# Altium schematic sheet MB_ps_io.SchDoc: Материнская плата
size 420 x 297 mm; DrawnBy: В.Титов; DocumentNumber: ХХХХ.468179.001 Э3; SheetNumber: 2; SheetTotal: 7; DocumentType: Схема электрическая принципиальная; Title2: Питание процессора
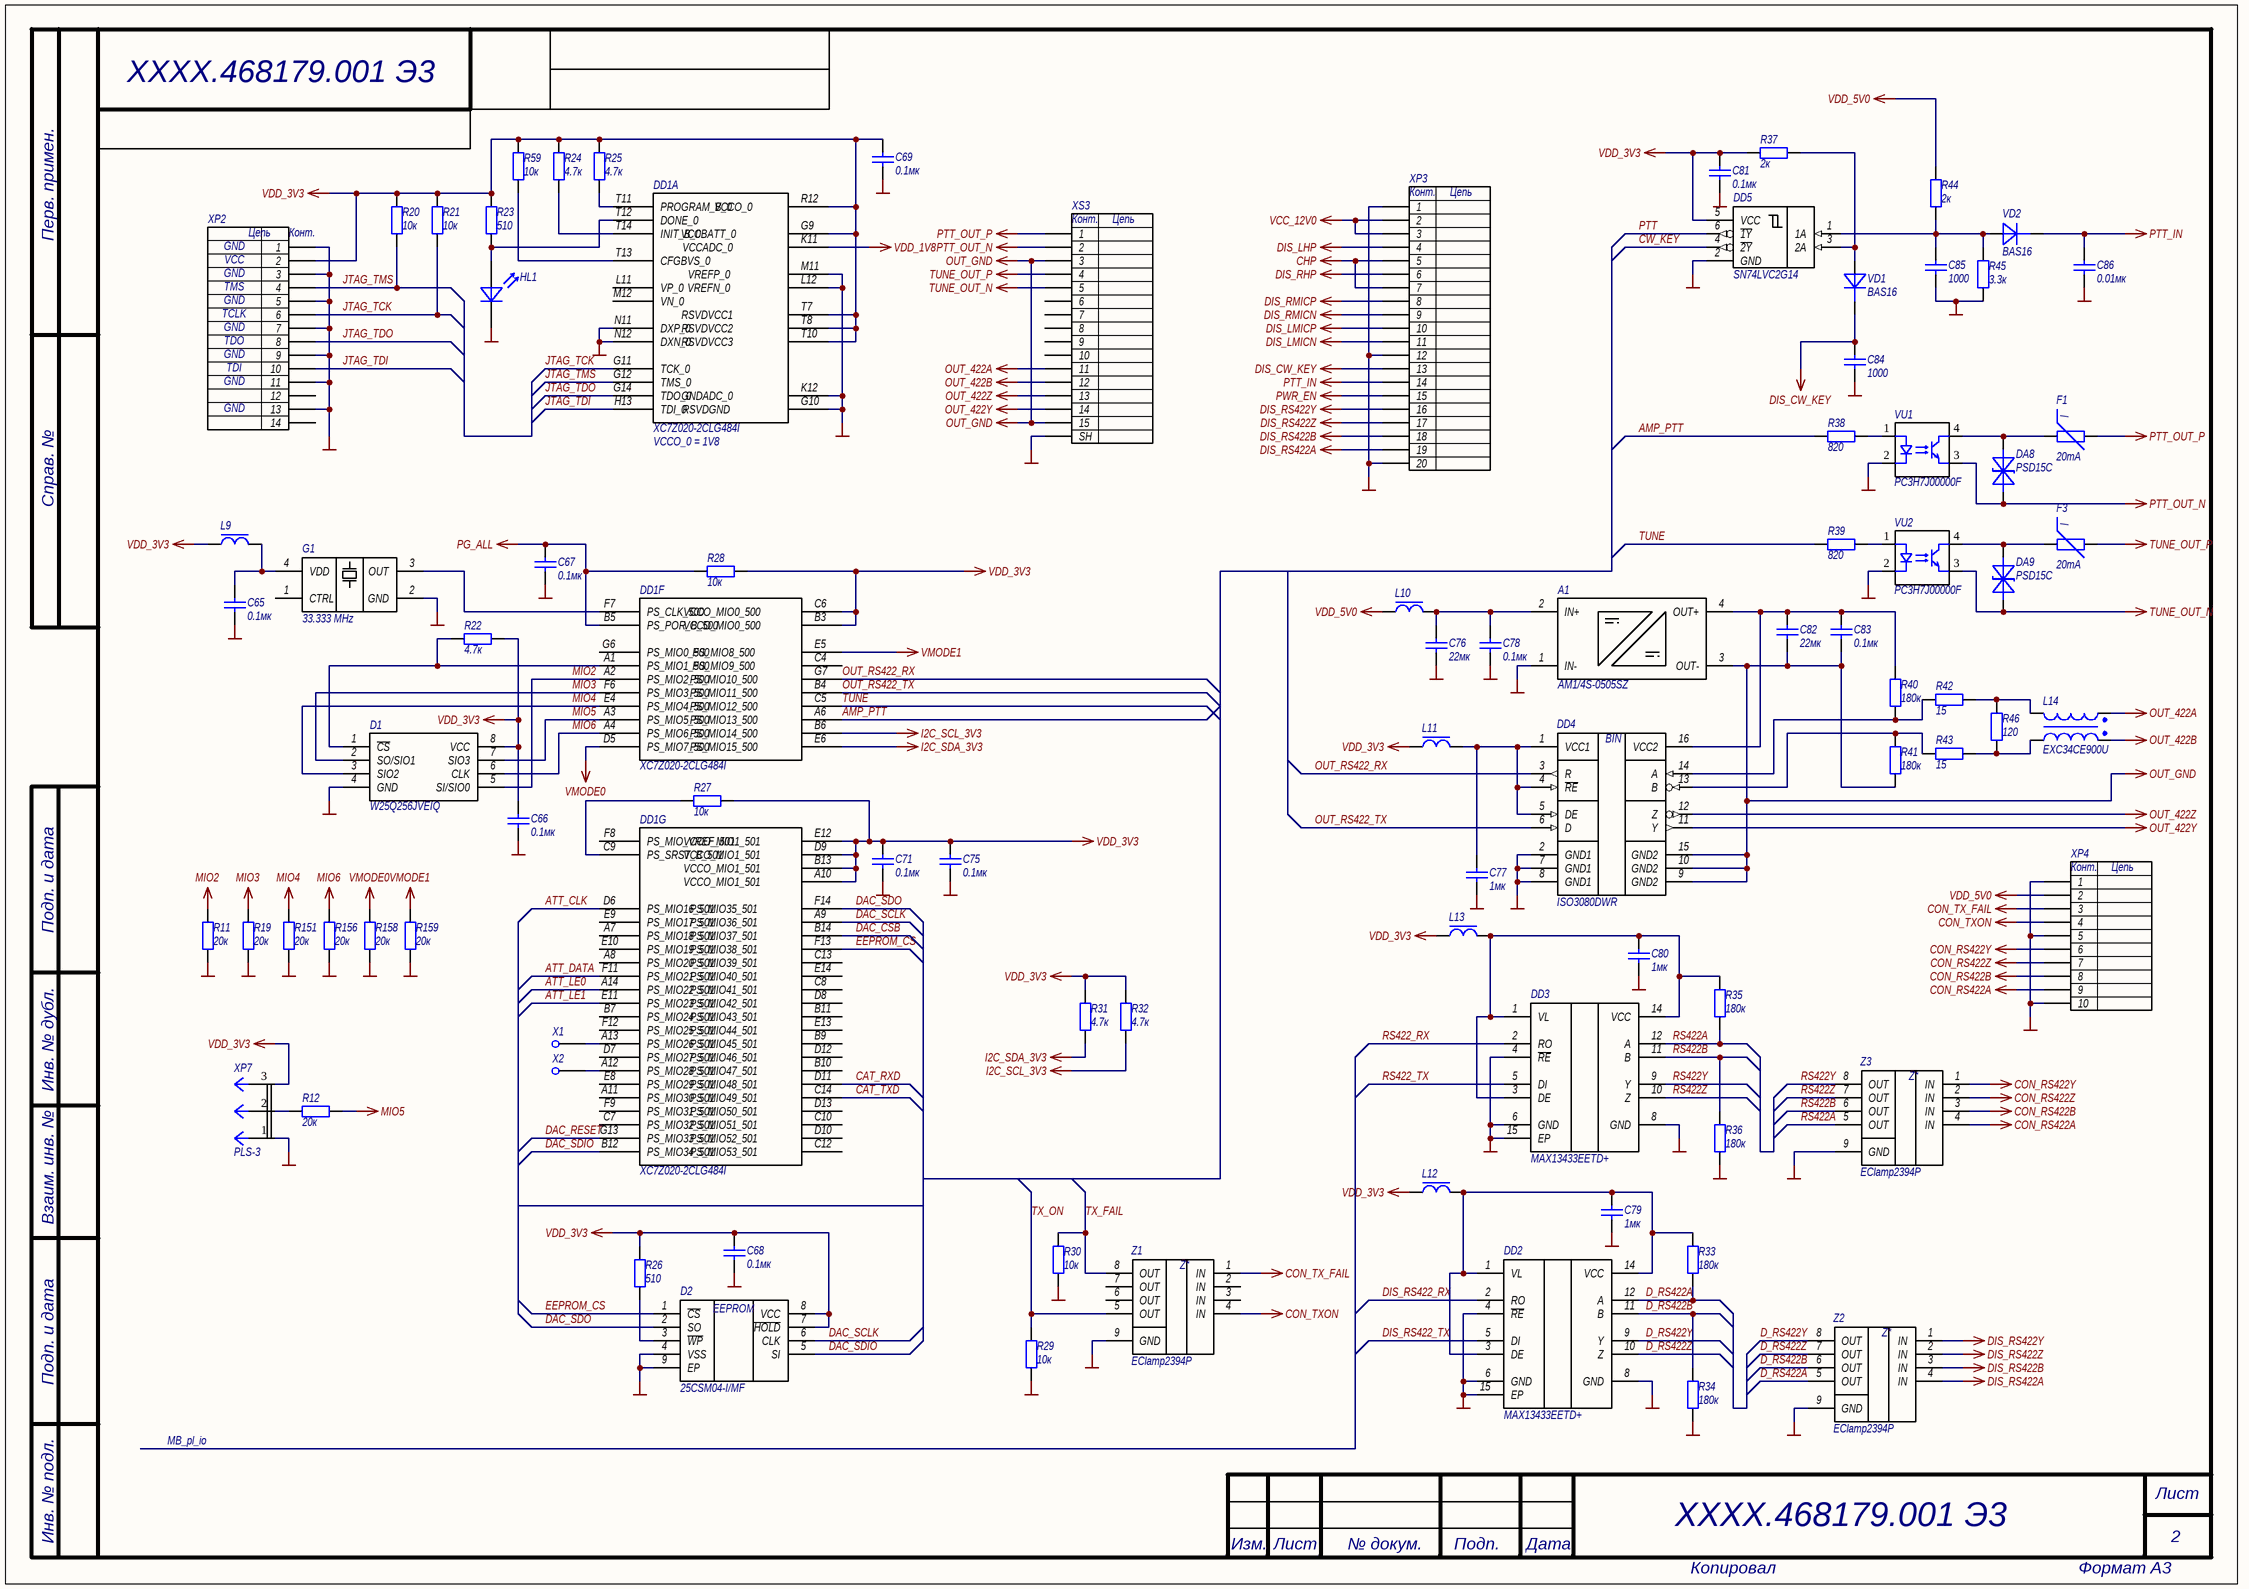
[diagram p0: MB_ps_io.SchDoc]

## Parts
A1  AM1/4S-0505SZ  [Series AM1/4S-Z]
C65  0.1мк  [CAPC1005X06N]
C66  0.1мк  [CAPC1005X06N]
C67  0.1мк  [CAPC1005X06N]
C68  0.1мк  [CAPC1005X06N]
C69  0.1мк  [CAPC1005X06N]
C71  0.1мк  [CAPC1005X06N]
C75  0.1мк  [CAPC1005X06N]
C76  22мк  [CAPC2012X12L]
C77  1мк  [CAPC1005X06N]
C78  0.1мк  [CAPC1005X06N]
C79  1мк  [CAPC1005X06N]
C80  1мк  [CAPC1005X06N]
C81  0.1мк  [CAPC1005X06N]
C82  22мк  [CAPC2012X12L]
C83  0.1мк  [CAPC1005X06N]
C84  1000  [CAPC1005X06N]
C85  1000  [CAPC1005X06N]
C86  0.01мк  [CAPC1005X06N]
D1  W25Q256JVEIQ  [SON127P800X70_HS-9N]
D2  25CSM04-I/MF  [SON127P600X80_HS-9N]
DA8  PSD15C  [SOT0P254X110-2N]
DA9  PSD15C  [SOT0P254X110-2N]
DD1  XC7Z020-2CLG484I  [BGA484C80P22X22_1900X1900X160]  (parts A,F,G of 9)
DD2  MAX13433EETD+  [SON40P300X80_HS-15L]
DD3  MAX13433EETD+  [SON40P300X80_HS-15L]
DD4  ISO3080DWR  [SOIC127P1030X265-16N]
DD5  SN74LVC2G14  [SOT65P210X110-6L]
F1  20mA  [FUSC1607X85N]
F3  20mA  [FUSC1607X85N]
G1  33.333 MHz  [XTAL_ASFLMB-33.333MHZ-LC-T]
HL1  (no value)  [CD1608-0603_GREEN]
L9  BLM18PG121SN1D  [INDC1608X08L]  (value not drawn)
L10  BLM18PG121SN1D  [INDC1608X08L]  (value not drawn)
L11  BLM18PG121SN1D  [INDC1608X08L]  (value not drawn)
L12  BLM18PG121SN1D  [INDC1608X08L]  (value not drawn)
L13  BLM18PG121SN1D  [INDC1608X08L]  (value not drawn)
L14  EXC34CE900U  [EXC34CE900U]
R11  20к  [RESC1005X06N]
R12  20к  [RESC1005X06N]
R19  20к  [RESC1005X06N]
R20  10к  [RESC1005X06N]
R21  10к  [RESC1005X06N]
R22  4.7к  [RESC1005X06N]
R23  510  [RESC1005X06N]
R24  4.7к  [RESC1005X06N]
R25  4.7к  [RESC1005X06N]
R26  510  [RESC1005X06N]
R27  10к  [RESC1005X06N]
R28  10к  [RESC1005X06N]
R29  10к  [RESC1005X06N]
R30  10к  [RESC1005X06N]
R31  4.7к  [RESC1005X06N]
R32  4.7к  [RESC1005X06N]
R33  180к  [RESC1005X06N]
R34  180к  [RESC1005X06N]
R35  180к  [RESC1005X06N]
R36  180к  [RESC1005X06N]
R37  2к  [RESC1005X06N]
R38  820  [RESC1005X06N]
R39  820  [RESC1005X06N]
R40  180к  [RESC1005X06N]
R41  180к  [RESC1005X06N]
R42  15  [RESC1005X06N]
R43  15  [RESC1005X06N]
R44  2к  [RESC1005X06N]
R45  3.3к  [RESC1005X06N]
R46  120  [RESC1005X06N]
R59  10к  [RESC1005X06N]
R151  20к  [RESC1005X06N]
R156  20к  [RESC1005X06N]
R158  20к  [RESC1005X06N]
R159  20к  [RESC1005X06N]
VD1  BAS16  [SOT23_N]
VD2  BAS16  [SOT23_N]
VU1  PC3H7J00000F  [SO4-170-1.27]
VU2  PC3H7J00000F  [SO4-170-1.27]
X1  Конструктивный элемент  [PIN2_PROBE]  (value not drawn)  (no BOM)
X2  Конструктивный элемент  [PIN2_PROBE]  (value not drawn)  (no BOM)
XP2  IDC2-14MS  [IDC2-14MS]  (value not drawn)
XP3  FH12-20S-0.5SVA  [FH12-20S-0.5SVA]  (value not drawn)
XP4  FH12-10S-0.5SVA  [FH12-10S-0.5SH]  (value not drawn)
XP7  PLS-3  [PLS-3 (DS1021-1x3)]
XS3  DS1038-15F  [DS1038-15F]  (value not drawn)
Z1  EClamp2394P  [SON50P160X65_HS-9N]
Z2  EClamp2394P  [SON50P160X65_HS-9N]
Z3  EClamp2394P  [SON50P160X65_HS-9N]

## Nets
CHP: XP3.5 XP3.7
CON_RS422A: XP4.9 Z3.4(IN)
CON_RS422B: XP4.8 Z3.3(IN)
CON_RS422Y: XP4.6 Z3.1(IN)
CON_RS422Z: XP4.7 Z3.2(IN)
CON_TX_FAIL: XP4.3 Z1.1(IN)
CON_TXON: XP4.4 Z1.4(IN)
DIS_CW_KEY: C84.2 VD1.3(K) XP3.13
DIS_LHP: XP3.4
DIS_LMICN: XP3.11
DIS_LMICP: XP3.10
DIS_RHP: XP3.6
DIS_RMICN: XP3.9
DIS_RMICP: XP3.8
DIS_RS422A: XP3.19 Z2.4(IN)
DIS_RS422B: XP3.18 Z2.3(IN)
DIS_RS422Y: XP3.16 Z2.1(IN)
DIS_RS422Z: XP3.17 Z2.2(IN)
GND: A1.1(IN-) C65.1 C66.1 C67.1 C68.1 C69.1 C71.1 C75.1 C76.1 C77.1 C78.1 C79.1 C80.1 C81.1 C84.1 C85.1 C86.1 D1.4(GND) D2.4(VSS) D2.9(EP) DD1.G10(RSVDGND) DD1.K12(GNDADC_0) DD1.L12(VREFN_0) DD1.M11(VREFP_0) DD1.N11(DXP_0) DD1.N12(DXN_0) DD2.4(~{RE}) DD2.6(GND) DD2.8(GND) DD2.15(EP) DD3.4(~{RE}) DD3.6(GND) DD3.8(GND) DD3.15(EP) DD4.2(GND1) DD4.7(GND1) DD4.8(GND1) DD5.2(GND) G1.2(GND) HL1.2(K) R11.1 R19.1 R29.1 R30.1 R34.1 R36.1 R45.2 R151.1 R156.1 R158.1 R159.1 VU1.2(K) VU2.2(K) XP2.1 XP2.3 XP2.5 XP2.7 XP2.9 XP2.11 XP2.13 XP3.1 XP3.12 XP3.20 XP4.1 XP4.5 XP4.10 XP7.1 XS3.16(SH) Z1.9(GND) Z2.9(GND) Z3.9(GND)
I2C_SCL_3V3: DD1.B6(PS_MIO14_500) R32.2
I2C_SDA_3V3: DD1.E6(PS_MIO15_500) R31.2
MIO2: D1.5(SI/SIO0) DD1.A2(PS_MIO2_500) R11.2
MIO3: D1.2(SO/SIO1) DD1.F6(PS_MIO3_500) R19.2
MIO4: D1.3(SIO2) DD1.E4(PS_MIO4_500) R151.2
MIO5: D1.7(SIO3) DD1.A3(PS_MIO5_500) R12.2
MIO6: D1.6(CLK) DD1.A4(PS_MIO6_500) R156.2
OUT_422A: L14.1 XS3.11
OUT_422B: L14.4 XS3.12
OUT_422Y: DD4.11(Y) XS3.14
OUT_422Z: DD4.12(Z) XS3.13
OUT_GND: A1.3(OUT-) C82.1 C83.1 DD4.9(GND2) DD4.10(GND2) DD4.15(GND2) R41.1 XS3.3 XS3.15
PG_ALL: C67.2 DD1.B5(PS_POR_B_500) R28.1
PTT_IN: C86.2 VD2.3(K) XP3.14
PTT_OUT_N: DA8.2 VU1.3(E) XS3.2
PTT_OUT_P: F1.1 XS3.1
PWR_EN: XP3.15
TUNE_OUT_N: DA9.2 VU2.3(E) XS3.5
TUNE_OUT_P: F3.1 XS3.4
VCC_12V0: XP3.2 XP3.3
VDD_1V8: DD1.K11(VCCADC_0)
VDD_3V3: C66.2 C68.2 C69.2 C71.2 C75.2 C81.2 D1.8(VCC) D2.7(~{HOLD}) D2.8(VCC) DD1.A10(VCCO_MIO1_501) DD1.B3(VCCO_MIO0_500) DD1.B13(VCCO_MIO1_501) DD1.C6(VCCO_MIO0_500) DD1.D9(VCCO_MIO1_501) DD1.E12(VCCO_MIO1_501) DD1.G9(VCCBATT_0) DD1.R12(VCCO_0) DD1.T7(RSVDVCC1) DD1.T8(RSVDVCC2) DD1.T10(RSVDVCC3) DD5.5(VCC) L9.1 L11.1 L12.1 L13.1 R20.1 R21.1 R22.2 R23.1 R24.1 R25.1 R26.1 R27.2 R28.2 R31.1 R32.1 R37.2 R59.2 XP2.2 XP7.3
VDD_5V0: L10.1 R44.2 XP4.2
VMODE0: DD1.D5(PS_MIO7_500) R158.2
VMODE1: DD1.E5(PS_MIO8_500) R159.2
AMP_PTT: DD1.A6(PS_MIO13_500) R38.1
ATT_CLK: DD1.D6(PS_MIO16_501)
ATT_DATA: DD1.F11(PS_MIO21_501)
ATT_LE0: DD1.A14(PS_MIO22_501)
ATT_LE1: DD1.E11(PS_MIO23_501)
CAT_RXD: DD1.D11(PS_MIO48_501)
CAT_TXD: DD1.C14(PS_MIO49_501)
CW_KEY: DD5.4(~{2Y})
D_RS422A: DD2.12(A) R33.1 Z2.5(OUT)
D_RS422B: DD2.11(B) R34.2 Z2.6(OUT)
D_RS422Y: DD2.9(Y) Z2.8(OUT)
D_RS422Z: DD2.10(Z) Z2.7(OUT)
DAC_CSB: DD1.B14(PS_MIO37_501)
DAC_RESET: DD1.G13(PS_MIO33_501)
DAC_SCLK: D2.6(CLK) DD1.A9(PS_MIO36_501)
DAC_SDIO: D2.5(SI) DD1.B12(PS_MIO34_501)
DAC_SDO: D2.2(SO) DD1.F14(PS_MIO35_501)
DIS_RS422_RX: DD2.2(RO)
DIS_RS422_TX: DD2.5(DI)
EEPROM_CS: D2.1(~{CS}) DD1.F13(PS_MIO38_501)
JTAG_TCK: DD1.G11(TCK_0) R21.2 XP2.6
JTAG_TDI: DD1.H13(TDI_0) XP2.10
JTAG_TDO: DD1.G14(TDO_0) XP2.8
JTAG_TMS: DD1.G12(TMS_0) R20.2 XP2.4
OUT_RS422_RX: DD1.G7(PS_MIO10_500) DD4.3(R)
OUT_RS422_TX: DD1.B4(PS_MIO11_500) DD4.6(D)
PTT: DD5.6(~{1Y})
RS422_RX: DD3.2(RO)
RS422_TX: DD3.5(DI)
RS422A: DD3.12(A) R35.1 Z3.5(OUT)
RS422B: DD3.11(B) R36.2 Z3.6(OUT)
RS422Y: DD3.9(Y) Z3.8(OUT)
RS422Z: DD3.10(Z) Z3.7(OUT)
TUNE: DD1.C5(PS_MIO12_500) R39.1
TX_FAIL: R30.2 Z1.8(OUT)
TX_ON: R29.2 Z1.5(OUT)
NetA1_2: A1.2(IN+) C76.2 C78.2 L10.2
NetA1_4: A1.4(OUT+) C82.2 C83.2 DD4.16(VCC2) R40.2
NetC65_2: C65.2 G1.4(VDD) L9.2
NetC77_2: C77.2 DD4.1(VCC1) DD4.4(~{RE}) DD4.5(DE) L11.2
NetC79_2: C79.2 DD2.1(VL) DD2.3(DE) DD2.14(VCC) L12.2 R33.2
NetC80_2: C80.2 DD3.1(VL) DD3.3(DE) DD3.14(VCC) L13.2 R35.2
NetC85_2: C85.2 DD5.1(1A) R44.1 R45.1 VD2.1(A)
NetD1_1: D1.1(~{CS}) DD1.A1(PS_MIO1_500) R22.1
NetD2_3: D2.3(~{WP}) R26.2
NetDA8_1: DA8.1 F1.2 VU1.4(C)
NetDA9_1: DA9.1 F3.2 VU2.4(C)
NetDD1_A12   : DD1.A12(PS_MIO28_501) X2.1
NetDD1_A13   : DD1.A13(PS_MIO26_501) X1.1
NetDD1_C9    : DD1.C9(PS_SRST_B_501) R27.1
NetDD1_F7    : DD1.F7(PS_CLK_500) G1.3(OUT)
NetDD1_T11   : DD1.T11(PROGRAM_B_0) R25.2
NetDD1_T12   : DD1.T12(DONE_0) HL1.1(A) R23.2
NetDD1_T13   : DD1.T13(CFGBVS_0) R59.1
NetDD1_T14   : DD1.T14(INIT_B_0) R24.2
NetDD4_13: DD4.13(B) R41.2 R43.1
NetDD4_14: DD4.14(A) R40.1 R42.1
NetDD5_3: DD5.3(2A) R37.1 VD1.1(A)
NetL14_2: L14.2 R42.2 R46.1
NetL14_3: L14.3 R43.2 R46.2
NetR12_1: R12.1 XP7.2
NetR38_2: R38.2 VU1.1(A)
NetR39_2: R39.2 VU2.1(A)

Not connected (* = marked no-connect by the designer): DD1 A7    (PS_MIO18_501_____________) A8    (PS_MIO20_501_____________) A11   (PS_MIO30_501_____________) B7    (PS_MIO24_501_____________) B9    (PS_MIO45_501_____________) B10   (PS_MIO47_501_____________) B11   (PS_MIO43_501_____________) C4    (PS_MIO9_500______________) C7    (PS_MIO32_501_____________) C8    (PS_MIO41_501_____________) C10   (PS_MIO51_501_____________) C12   (PS_MIO53_501_____________) C13   (PS_MIO39_501_____________) D7    (PS_MIO27_501_____________) D8    (PS_MIO42_501_____________) D10   (PS_MIO52_501_____________) D12   (PS_MIO46_501_____________) D13   (PS_MIO50_501_____________) E8    (PS_MIO29_501_____________) E9    (PS_MIO17_501_____________) E10   (PS_MIO19_501_____________) E13   (PS_MIO44_501_____________) E14   (PS_MIO40_501_____________) F8    (PS_MIO_VREF_501__________) F9    (PS_MIO31_501_____________) F12   (PS_MIO25_501_____________) G6    (PS_MIO0_500______________) L11   (VP_0_____________________) M12   (VN_0_____________________); G1 1(CTRL); XP2 12 14; XS3 6 7 8 9 10; Z1 2(IN) 3(IN) 6(OUT) 7(OUT)

## Notes on the sheet
- (near DD1) VCCO_0 = 1V8
- MB_pl_io
- Перв. примен.
- Справ. №
- Подп. и дата
- Инв. № дубл.
- Взаим. инв. №
- Инв. № подл.
- Лист
- Изм.
- № докум.
- Подп.
- Дата
- Копировал
- Формат А3
- (in symbol Микросхема 25CSM04-I/MF) EEPROM
- (in symbol Микросхема ISO3080DWR) BIN
- (in symbol Соединитель DHR-15FB (DS1038-15F)) Конт.; Цепь
- (in symbol Соединитель FH12-10S-0.5SVA) Конт.; Цепь
- (in symbol Соединитель FH12-20S-0.5SVA) Конт.; Цепь
- (in symbol Соединитель IDC2-14MS) Цепь; Конт.; GND; VCC; TMS; TCLK; TDO; TDI
- (in symbol Фильтр EMI EClamp2394P) Z*
- (in symbol Чип предохранитель 0ZCM0002FF2G) I

## Library data of the parts
A1 = Модуль AM1/4S-0505SZ: 0.25 Watt | DC-DC Converter; Manufacturer: flex; Value: AM1/4S-0505SZ; ComponentLink1Description: datasheet; ComponentLink1URL: http://www.aimtec.com/site/Aimtec/files/Datasheet/HighResolution/AM1_4S-Z.pdf?ft4=0-357
C65-C69 C71 C75 C78 C81 C83 = Кер.ЧИП конд. 0402 0.1мкФ X7R 10%, 16В: Кер. ЧИП-конденсатор; Power/Voltage: 16В; TKE: X7R; Tolerance: ±10%; PackageReference: 0402; Value: 0.1мк
C76 C82 = Кер.ЧИП конд. 0805 22мкФ X5R 10% 16В: Кер. ЧИП-конденсатор; Manufacturer: TDK; ManufacturerPartNumber: C2012X5R1C226KT; Power/Voltage: 16В; TKE: X5R; Tolerance: ±10%; Value: 22мк
C77 C79 C80 = Кер.ЧИП конд. 0402 1мкФ X5R 10%, 10В: Кер. ЧИП-конденсатор; Power/Voltage: 10В; TKE: X5R; Tolerance: ±10%; PackageReference: 0402; Value: 1мк
C84 C85 = Кер.ЧИП конд. 0402 1000пФ NP0 5%, 50В: Кер. ЧИП-конденсатор; Power/Voltage: 50В; TKE: NPO; Tolerance: ±5%; PackageReference: 0402; Value: 1000
C86 = Кер.ЧИП конд. 0402 0.01мкФ X7R 10%, 50В: Кер. ЧИП-конденсатор; Power/Voltage: 50В; TKE: X7R; Tolerance: ±20%; Value: 0.01мк
D1 = Микросхема W25Q256JVEIQ: 3V 256M-BIT SERIAL FLASH MEMORY WITH DUAL/QUAD SPI /; Manufacturer: WINBOND; Value: W25Q256JVEIQ
D2 = Микросхема 25CSM04-I/MF: 4-Mbit SPI Serial EEPROM with 128-Bit Serial Number and Enhanced Write Protection; Manufacturer: MICROCHIP; ComponentLink1Description: Datasheet; ComponentLink1URL: https://ww1.microchip.com/downloads/en/DeviceDoc/25CSM04-4-Mbit-SPI-Serial-EEPROM-With-128-Bit-Serial-Number-and-Enhanced-Write-Protection-20005817C.pdf; Value: 25CSM04-I/MF
DA8 DA9 = ЧИП защитный диод PSD15C: HIGH POWERED TVS; Manufacturer: PROTEK; Power/Voltage: 15В; Value: PSD15C; ComponentLink1Description: datasheet; ComponentLink1URL: https://www.protekdevices.com/xyz/documents/datasheets/psd.pdf
DD1 = Микросхема XC7Z020-2CLG484I: Zynq®-7000 SoC Family; Manufacturer: XILINX; Value: XC7Z020-2CLG484I; ComponentLink1Description: datasheet; ComponentLink1URL: https://www.xilinx.com/support/documentation/data_sheets/ds925-zynq-ultrascale-plus.pdf
DD2 DD3 = Микросхема MAX13433EETD+: RS-422 Transceivers with Low-Voltage Logic Interface 16M; Manufacturer: Maxim; Value: MAX13433EETD+; ComponentLink1Description: datasheet; ComponentLink1URL: https://datasheets.maximintegrated.com/en/ds/MAX13430E-MAX13433E.pdf
DD4 = Микросхема ISO3080DWR: ISOLATED 5-V FULL DUPLEX RS-485 TRANSCEIVERS 200 kbps /; Manufacturer: TI; Value: ISO3080DWR
DD5 = Микросхема SN74LVC2G14DCKR: Dual Schmitt-Trigger Inverter; Manufacturer: TI; Value: SN74LVC2G14; ComponentLink1Description: datasheet; ComponentLink1URL: http://www.ti.com/lit/ds/symlink/sn74auc1g04.pdf
F1 F3 = Чип предохранитель 0ZCM0002FF2G: ЧИП-резистор; Manufacturer: Belfuse; PackageReference: 0603; Value: 20mA; ManufacturerPartNumber: 0ZCM0002FF2G
G1 = Генератор кварцевый ASFLMB-33.333MHZ: 33.333 MHz HCMOS/TTL Clock Oscillator; Manufacturer: Abracom; Value: 33.333 MHz
HL1 = Светодиод SMD FYLS-0603UGC (зеленый): ЧИП-светодиод; Manufacturer: FORYARD; PackageDocument: revH, May-2002; Published: 17-Sep-2003; DatasheetDocument: May-2002; PackageReference: 0603; Publisher: Altium Limited; ComponentLink1Description: Manufacturer Link; ComponentLink1URL: http://www.irf.com/; ComponentLink2Description: Datasheet; ComponentLink2URL: http://www.irf.com/product-info/datasheets/data/10MQ060N.pdf; Value: зеленый; ManufacturerPartNumber: FYLS-0603UGC
L9-L13 = ЧИП дроссель 0603 BLM18PG121SN1D: SMD EMI Suppression Filter EMIFIL; Manufacturer: Murata; ManufacturerPartNumber: BLM18PG121SN1D; Value: BLM18PG121SN1D
L14 = ЧИП синфазный фильтр 0805 EXC34CE900U: Common Mode Noise Filters EXC34CG/CE type; Manufacturer: Panasonic; ManufacturerPartNumber: EXC34CE900U; Value: EXC34CE900U; ComponentLink1Description: datasheet; ComponentLink1URL: https://industrial.panasonic.com/cdbs/www-data/pdf/AWE0000/AWE0000C276.pdf
R11 R12 R19 R151 R156 R158 R159 = Чип резистор 0402 20 кОм, 5%: ЧИП-резистор; Tolerance: ±5%; TKE: 100 ppm/°С; PackageReference: 0402; Value: 20к
R20 R21 R27-R30 R59 = Чип резистор 0402 10 кОм, 5%: ЧИП-резистор; Tolerance: ±5%; TKE: 100 ppm/°С; PackageReference: 0402; Value: 10к
R22 R31 R32 = Чип резистор 0402 4,7 кОм, 5%: ЧИП-резистор; Tolerance: ±5%; TKE: 100 ppm/°С; PackageReference: 0402; Value: 4.7к
R23 R26 = Чип резистор 0402 510 Ом, 5%: ЧИП-резистор; Tolerance: ±5%; TKE: 100 ppm/°С; PackageReference: 0402; Value: 510
R24 R25 = Чип резистор 0402 4,7 кОм, 1%: ЧИП-резистор; Tolerance: ±1%; TKE: 100 ppm/°С; PackageReference: 0402; Value: 4.7к
R33-R36 R40 R41 = Чип резистор 0402 180 кОм, 5%: ЧИП-резистор; Tolerance: ±5%; TKE: 100 ppm/°С; PackageReference: 0402; Value: 180к
R37 R44 = Чип резистор 0402 2 кОм, 5%: ЧИП-резистор; Tolerance: ±5%; TKE: 100 ppm/°С; PackageReference: 0402; Value: 2к
R38 R39 = Чип резистор 0402 820 Ом, 5%: ЧИП-резистор; Tolerance: ±5%; TKE: 100 ppm/°С; PackageReference: 0402; Value: 820
R42 R43 = Чип резистор 0402 15 Ом, 5%: ЧИП-резистор; Tolerance: ±5%; TKE: 100 ppm/°С; PackageReference: 0402; Value: 15
R45 = Чип резистор 0402 3,3 кОм, 5%: ЧИП-резистор; Tolerance: ±5%; TKE: 100 ppm/°С; PackageReference: 0402; Value: 3.3к
R46 = Чип резистор 0402 120 Ом, 5%: ЧИП-резистор; Tolerance: ±5%; TKE: 100 ppm/°С; PackageReference: 0402; Value: 120
VD1 VD2 = ЧИП диод BAS16: High-speed switching diodes; Manufacturer: Nexperia; Power/Voltage: 100В; ManufacturerPartNumber: BAS16; Value: BAS16; ComponentLink1Description: datasheet; ComponentLink1URL: https://assets.nexperia.com/documents/data-sheet/BAS16_SER.pdf
VU1 VU2 = Оптопара транзисторная PC3H7J00000F: Mini-falt Package, General Purpose Half Pitch Photocouper; PackageReference: SOP-4; ComponentLink1Description: Manufacturer Link; ComponentLink1URL: http://www.vishay.com/optocouplers/list/product-83640/; ComponentLink2Description: Datasheet; ComponentLink2URL: http://www.vishay.com/docs/83640/83640.pdf; Value: PC3H7J00000F
X1 X2 = Соединение под пайку: Соединитель; Value: Конструктивный элемент
XP2 = Соединитель IDC2-14MS: JTAG Xilinx IDC2-14MS; Manufacturer: Molex; Value: IDC2-14MS
XP3 = Соединитель FH12-20S-0.5SVA: FPC Connectors, Flex-to-Board, 20 Position, .5mm [.02in]; Value: FH12-20S-0.5SVA
XP4 = Соединитель FH12-10S-0.5SVA: 0.5mm  Pitch FPC/FFC Connector FH12 Series; Manufacturer: Hirose; Value: FH12-10S-0.5SVA
XP7 = Соединитель PLS-3 (DS1021-1x3): Вилка штыревая 2.54мм 1x3 прямая тип1; Value: PLS-3
XS3 = Соединитель DHR-15FB (DS1038-15F): Гнездо 15 pin высокой плотности на плату; Manufacturer: Connfly; Value: DS1038-15F
Z1-Z3 = Фильтр EMI EClamp2394P: ESD/EMI Protection  for Color LCD Interfaces; Manufacturer: SEMTECH; PackageReference: SLP2116P8; Value: EClamp2394P